# Altium schematic sheet ADCS_2.SchDoc
size A0 portrait; SheetNumber: 1; SheetTotal: 1
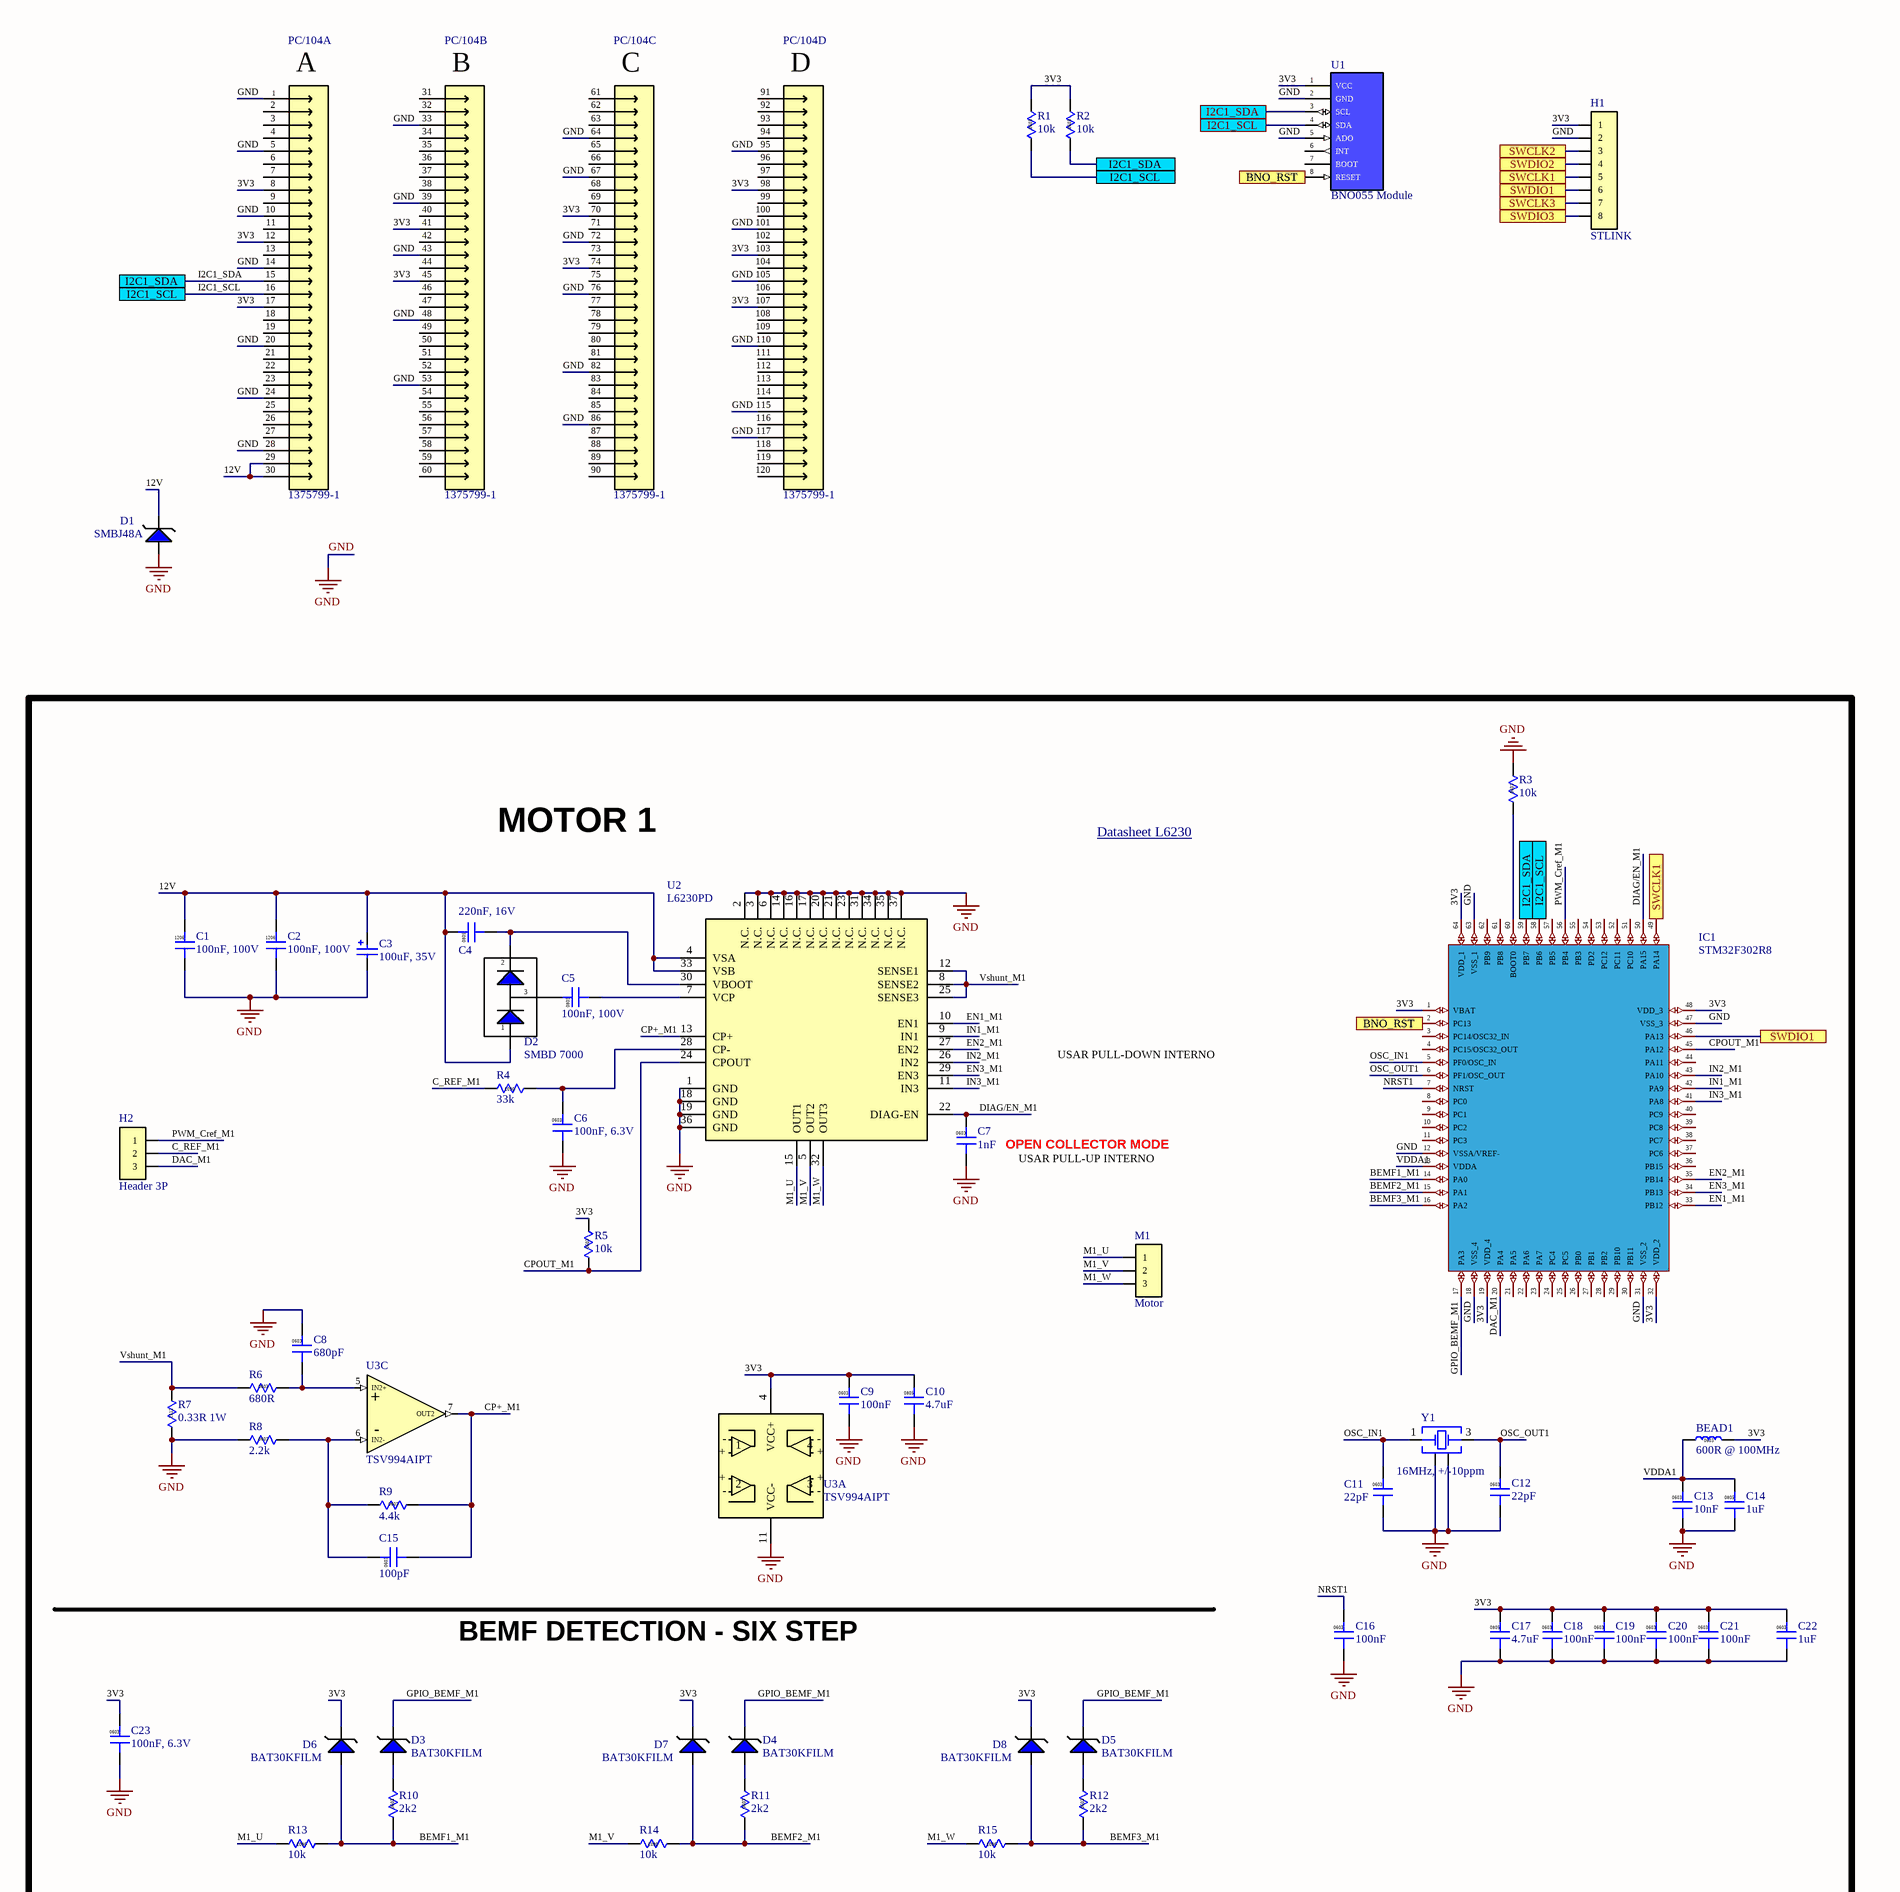
[diagram p0: ADCS_2.SchDoc, top]
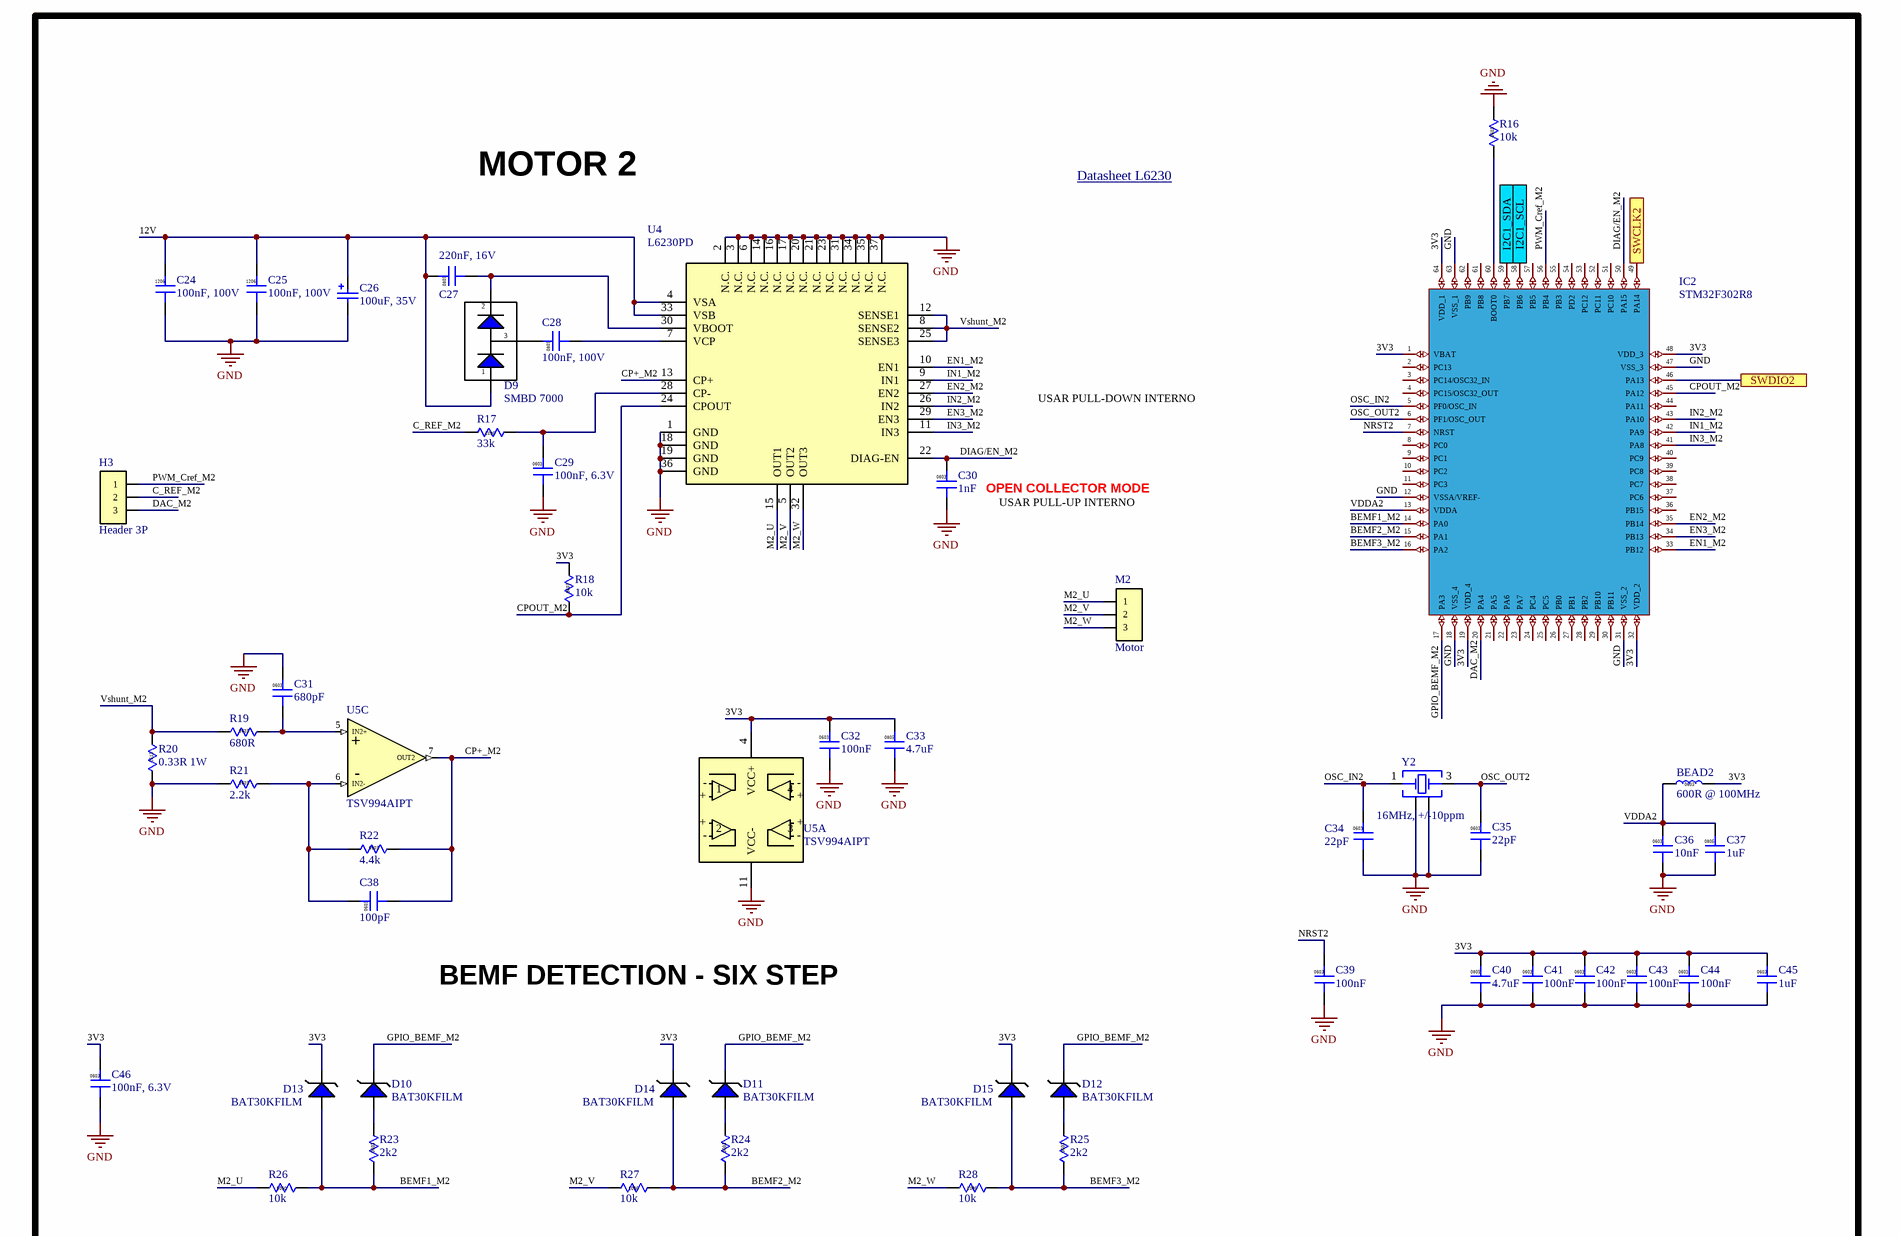
[diagram p1: ADCS_2.SchDoc, centre]
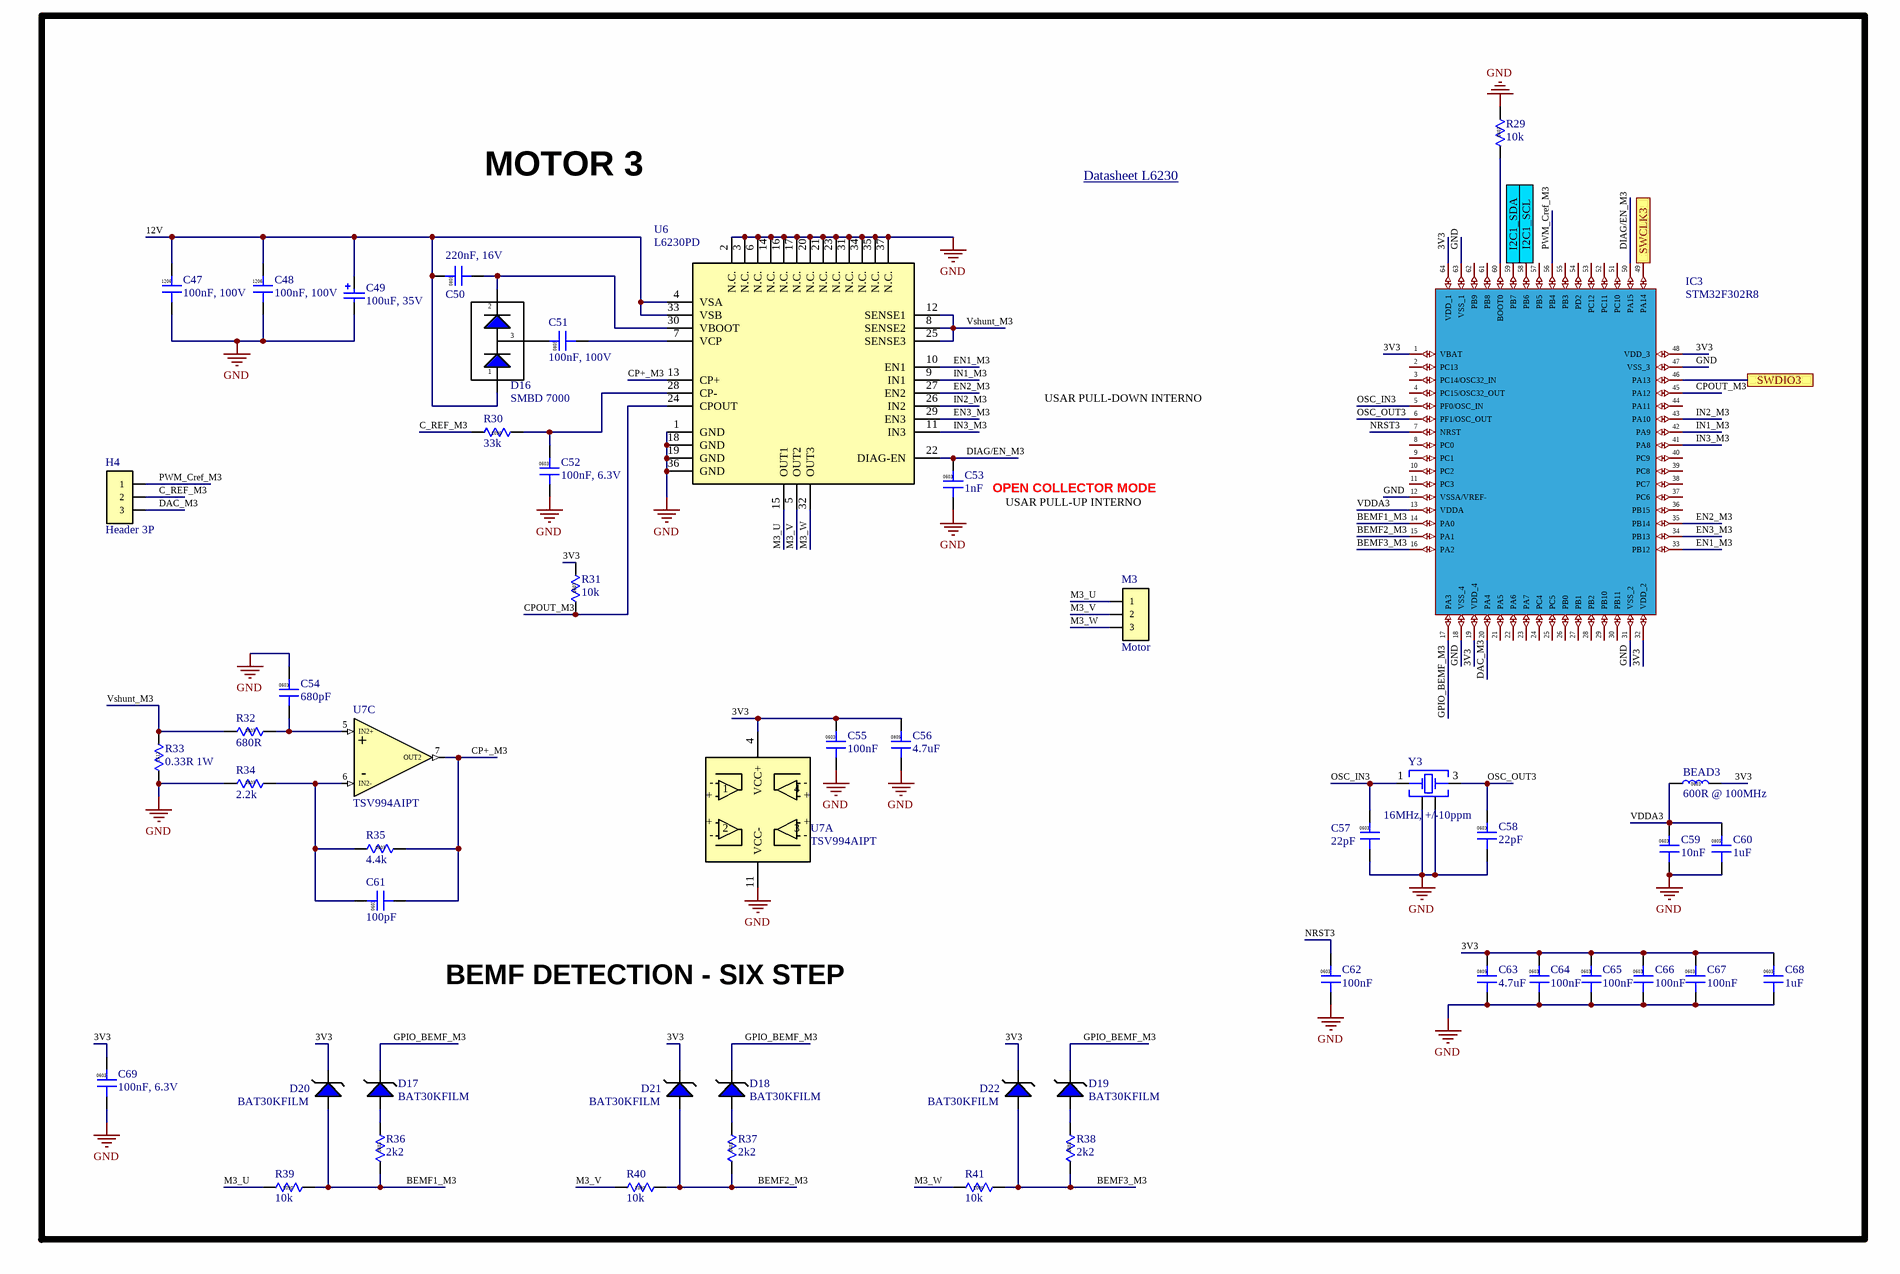
[diagram p2: ADCS_2.SchDoc, bottom]

## Parts
BEAD1  600R @ 100MHz  [IND0603]
BEAD2  600R @ 100MHz  [IND0603]
BEAD3  600R @ 100MHz  [IND0603]
C1  100nF, 100V  [CAP1206_090]
C2  100nF, 100V  [CAP1206_090]
C3  100uF, 35V  [WCAP-ASLI_6.3x7.7]
C4  220nF, 16V  [CAP0805_085]
C5  100nF, 100V  [CAP0805_085]
C6  100nF, 6.3V  [CAP0603_060]
C7  1nF  [CAP0603_060]
C8  680pF  [CAP0603_060]
C9  100nF  [CAP0603_060]
C10  4.7uF  [CAP0805_085]
C11  22pF  [CAP0603_060]
C12  22pF  [CAP0603_060]
C13  10nF  [CAP0603_040]
C14  1uF  [CAP0805_085]
C15  100pF  [CAP0603_060]
C16  100nF  [CAP0603_060]
C17  4.7uF  [CAP0805_125]
C18  100nF  [CAP0603_060]
C19  100nF  [CAP0603_060]
C20  100nF  [CAP0603_060]
C21  100nF  [CAP0603_060]
C22  1uF  [CAP0603_090]
C23  100nF, 6.3V  [CAP0603_060]
C24  100nF, 100V  [CAP1206_090]
C25  100nF, 100V  [CAP1206_090]
C26  100uF, 35V  [WCAP-ASLI_6.3x7.7]
C27  220nF, 16V  [CAP0805_085]
C28  100nF, 100V  [CAP0805_085]
C29  100nF, 6.3V  [CAP0603_060]
C30  1nF  [CAP0603_060]
C31  680pF  [CAP0603_060]
C32  100nF  [CAP0603_060]
C33  4.7uF  [CAP0805_085]
C34  22pF  [CAP0603_060]
C35  22pF  [CAP0603_060]
C36  10nF  [CAP0603_040]
C37  1uF  [CAP0805_085]
C38  100pF  [CAP0603_060]
C39  100nF  [CAP0603_060]
C40  4.7uF  [CAP0805_125]
C41  100nF  [CAP0603_060]
C42  100nF  [CAP0603_060]
C43  100nF  [CAP0603_060]
C44  100nF  [CAP0603_060]
C45  1uF  [CAP0603_090]
C46  100nF, 6.3V  [CAP0603_060]
C47  100nF, 100V  [CAP1206_090]
C48  100nF, 100V  [CAP1206_090]
C49  100uF, 35V  [WCAP-ASLI_6.3x7.7]
C50  220nF, 16V  [CAP0805_085]
C51  100nF, 100V  [CAP0805_085]
C52  100nF, 6.3V  [CAP0603_060]
C53  1nF  [CAP0603_060]
C54  680pF  [CAP0603_060]
C55  100nF  [CAP0603_060]
C56  4.7uF  [CAP0805_085]
C57  22pF  [CAP0603_060]
C58  22pF  [CAP0603_060]
C59  10nF  [CAP0603_040]
C60  1uF  [CAP0805_085]
C61  100pF  [CAP0603_060]
C62  100nF  [CAP0603_060]
C63  4.7uF  [CAP0805_125]
C64  100nF  [CAP0603_060]
C65  100nF  [CAP0603_060]
C66  100nF  [CAP0603_060]
C67  100nF  [CAP0603_060]
C68  1uF  [CAP0603_090]
C69  100nF, 6.3V  [CAP0603_060]
D1  SMBJ48A  [DO-214AA]
D2  SMBD 7000  [SOT-23]
D3  BAT30KFILM  [SOD-523]
D4  BAT30KFILM  [SOD-523]
D5  BAT30KFILM  [SOD-523]
D6  BAT30KFILM  [SOD-523]
D7  BAT30KFILM  [SOD-523]
D8  BAT30KFILM  [SOD-523]
D9  SMBD 7000  [SOT-23]
D10  BAT30KFILM  [SOD-523]
D11  BAT30KFILM  [SOD-523]
D12  BAT30KFILM  [SOD-523]
D13  BAT30KFILM  [SOD-523]
D14  BAT30KFILM  [SOD-523]
D15  BAT30KFILM  [SOD-523]
D16  SMBD 7000  [SOT-23]
D17  BAT30KFILM  [SOD-523]
D18  BAT30KFILM  [SOD-523]
D19  BAT30KFILM  [SOD-523]
D20  BAT30KFILM  [SOD-523]
D21  BAT30KFILM  [SOD-523]
D22  BAT30KFILM  [SOD-523]
H1  STLINK  [Header-8P]
H2  Header 3P  [Header-3P]
H3  Header 3P  [Header-3P]
H4  Header 3P  [Header-3P]
IC1  STM32F302R8  [LQFP-64-10X10X5]
IC2  STM32F302R8  [LQFP-64-10X10X5]
IC3  STM32F302R8  [LQFP-64-10X10X5]
M1  Motor  [Header-3P]
M2  Motor  [Header-3P]
M3  Motor  [Header-3P]
PC/104  1375799-1  [1375799-1]  (parts A,B,C,D of 4)
R1  10k  [RES0603]
R2  10k  [RES0603]
R3  10k  [RES0603]
R4  33k  [RES0603]
R5  10k  [RES0603]
R6  680R  [RES0603]
R7  0.33R 1W  [RES2512]
R8  2.2k  [RES0603]
R9  4.4k  [RES0603]
R10  2k2  [RES0603]
R11  2k2  [RES0603]
R12  2k2  [RES0603]
R13  10k  [RES0603]
R14  10k  [RES0603]
R15  10k  [RES0603]
R16  10k  [RES0603]
R17  33k  [RES0603]
R18  10k  [RES0603]
R19  680R  [RES0603]
R20  0.33R 1W  [RES2512]
R21  2.2k  [RES0603]
R22  4.4k  [RES0603]
R23  2k2  [RES0603]
R24  2k2  [RES0603]
R25  2k2  [RES0603]
R26  10k  [RES0603]
R27  10k  [RES0603]
R28  10k  [RES0603]
R29  10k  [RES0603]
R30  33k  [RES0603]
R31  10k  [RES0603]
R32  680R  [RES0603]
R33  0.33R 1W  [RES2512]
R34  2.2k  [RES0603]
R35  4.4k  [RES0603]
R36  2k2  [RES0603]
R37  2k2  [RES0603]
R38  2k2  [RES0603]
R39  10k  [RES0603]
R40  10k  [RES0603]
R41  10k  [RES0603]
U1  BNO055 Module  [BNO055_M_TH]
U2  L6230PD  [SOP65P1420X360-37N]
U3  TSV994AIPT  [SOP65P640X120-14N]  (parts A,C of 5)
U4  L6230PD  [SOP65P1420X360-37N]
U5  TSV994AIPT  [SOP65P640X120-14N]  (parts A,C of 5)
U6  L6230PD  [SOP65P1420X360-37N]
U7  TSV994AIPT  [SOP65P640X120-14N]  (parts A,C of 5)
Y1  16MHz, +/-10ppm  [WE-XTAL_CFPX-180]
Y2  16MHz, +/-10ppm  [WE-XTAL_CFPX-180]
Y3  16MHz, +/-10ppm  [WE-XTAL_CFPX-180]

## Blocks framed on the sheet
MOTOR 1: BEAD1 C1-C23 D2-D8 H2 IC1 M1 R3-R15 U2 U3 Y1
MOTOR 2: BEAD2 C24-C46 D9-D15 H3 IC2 M2 R16-R28 U4 U5 Y2
MOTOR 3: BEAD3 C47-C69 D16-D22 H4 IC3 M3 R29-R41 U6 U7 Y3

## Ports
BNO_RST, I2C1_SCL, I2C1_SDA, SWCLK1, SWCLK2, SWCLK3, SWDIO1, SWDIO2, SWDIO3

## Nets
GND: C1.2 C2.2 C3.1(N) C6.2 C7.2 C8.1 C9.2 C10.2 C11.2 C12.2 C13.2 C14.2 C16.2 C17.2 C18.2 C19.2 C20.2 C21.2 C22.2 C23.2 C24.2 C25.2 C26.1(N) C29.2 C30.2 C31.1 C32.2 C33.2 C34.2 C35.2 C36.2 C37.2 C39.2 C40.2 C41.2 C42.2 C43.2 C44.2 C45.2 C46.2 C47.2 C48.2 C49.1(N) C52.2 C53.2 C54.1 C55.2 C56.2 C57.2 C58.2 C59.2 C60.2 C62.2 C63.2 C64.2 C65.2 C66.2 C67.2 C68.2 C69.2 D1.1 H1.2 IC1.12(VSSA/VREF-) IC1.18(VSS_4) IC1.31(VSS_2) IC1.47(VSS_3) IC1.63(VSS_1) IC2.12(VSSA/VREF-) IC2.18(VSS_4) IC2.31(VSS_2) IC2.47(VSS_3) IC2.63(VSS_1) IC3.12(VSSA/VREF-) IC3.18(VSS_4) IC3.31(VSS_2) IC3.47(VSS_3) IC3.63(VSS_1) PC/104.1 PC/104.5 PC/104.10 PC/104.14 PC/104.20 PC/104.24 PC/104.28 PC/104.33 PC/104.39 PC/104.43 PC/104.48 PC/104.53 PC/104.64 PC/104.67 PC/104.72 PC/104.76 PC/104.82 PC/104.86 PC/104.95 PC/104.101 PC/104.105 PC/104.110 PC/104.115 PC/104.117 R3.2 R7.1 R8.1 R16.2 R20.1 R21.1 R29.2 R33.1 R34.1 U1.2(GND) U1.5(ADO) U2.1(GND) U2.2(N.C.) U2.3(N.C.) U2.6(N.C.) U2.14(N.C.) U2.16(N.C.) U2.17(N.C.) U2.18(GND) U2.19(GND) U2.20(N.C.) U2.21(N.C.) U2.23(N.C.) U2.31(N.C.) U2.34(N.C.) U2.35(N.C.) U2.36(GND) U2.37(N.C.) U3.11(VCC-) U4.1(GND) U4.2(N.C.) U4.3(N.C.) U4.6(N.C.) U4.14(N.C.) U4.16(N.C.) U4.17(N.C.) U4.18(GND) U4.19(GND) U4.20(N.C.) U4.21(N.C.) U4.23(N.C.) U4.31(N.C.) U4.34(N.C.) U4.35(N.C.) U4.36(GND) U4.37(N.C.) U5.11(VCC-) U6.1(GND) U6.2(N.C.) U6.3(N.C.) U6.6(N.C.) U6.14(N.C.) U6.16(N.C.) U6.17(N.C.) U6.18(GND) U6.19(GND) U6.20(N.C.) U6.21(N.C.) U6.23(N.C.) U6.31(N.C.) U6.34(N.C.) U6.35(N.C.) U6.36(GND) U6.37(N.C.) U7.11(VCC-) Y1.2(GND) Y1.4(GND) Y2.2(GND) Y2.4(GND) Y3.2(GND) Y3.4(GND)
3V3: BEAD1.2 BEAD2.2 BEAD3.2 C9.1 C10.1 C17.1 C18.1 C19.1 C20.1 C21.1 C22.1 C23.1 C32.1 C33.1 C40.1 C41.1 C42.1 C43.1 C44.1 C45.1 C46.1 C55.1 C56.1 C63.1 C64.1 C65.1 C66.1 C67.1 C68.1 C69.1 D6.2 D7.2 D8.2 D13.2 D14.2 D15.2 D20.2 D21.2 D22.2 H1.1 IC1.1(VBAT) IC1.19(VDD_4) IC1.32(VDD_2) IC1.48(VDD_3) IC1.64(VDD_1) IC2.1(VBAT) IC2.19(VDD_4) IC2.32(VDD_2) IC2.48(VDD_3) IC2.64(VDD_1) IC3.1(VBAT) IC3.19(VDD_4) IC3.32(VDD_2) IC3.48(VDD_3) IC3.64(VDD_1) PC/104.8 PC/104.12 PC/104.17 PC/104.41 PC/104.45 PC/104.70 PC/104.74 PC/104.98 PC/104.103 PC/104.107 R1.2 R2.2 R5.2 R18.2 R31.2 U1.1(VCC) U3.4(VCC+) U5.4(VCC+) U7.4(VCC+)
12V: C1.1 C2.1 C3.2(P) C4.1 C24.1 C25.1 C26.2(P) C27.1 C47.1 C48.1 C49.2(P) C50.1 D1.2 D2.1 D9.1 D16.1 PC/104.29 PC/104.30 U2.4(VSA) U2.33(VSB) U4.4(VSA) U4.33(VSB) U6.4(VSA) U6.33(VSB)
BEMF1_M1: D6.1 IC1.14(PA0) R10.1 R13.1
BEMF1_M2: D13.1 IC2.14(PA0) R23.1 R26.1
BEMF1_M3: D20.1 IC3.14(PA0) R36.1 R39.1
BEMF2_M1: D7.1 IC1.15(PA1) R11.1 R14.1
BEMF2_M2: D14.1 IC2.15(PA1) R24.1 R27.1
BEMF2_M3: D21.1 IC3.15(PA1) R37.1 R40.1
BEMF3_M1: D8.1 IC1.16(PA2) R12.1 R15.1
BEMF3_M2: D15.1 IC2.16(PA2) R25.1 R28.1
BEMF3_M3: D22.1 IC3.16(PA2) R38.1 R41.1
BNO_RST: IC1.2(PC13) U1.8(RESET) ; port BNO_RST
C_REF_M1: H2.2 R4.2
C_REF_M2: H3.2 R17.2
C_REF_M3: H4.2 R30.2
CP+_M1: C15.2 R9.2 U2.13(CP+) U3.7(OUT2)
CP+_M2: C38.2 R22.2 U4.13(CP+) U5.7(OUT2)
CP+_M3: C61.2 R35.2 U6.13(CP+) U7.7(OUT2)
CPOUT_M1: IC1.45(PA12) R5.1 U2.24(CPOUT)
CPOUT_M2: IC2.45(PA12) R18.1 U4.24(CPOUT)
CPOUT_M3: IC3.45(PA12) R31.1 U6.24(CPOUT)
DAC_M1: H2.3 IC1.20(PA4)
DAC_M2: H3.3 IC2.20(PA4)
DAC_M3: H4.3 IC3.20(PA4)
DIAG/EN_M1: C7.1 IC1.50(PA15) U2.22(DIAG-EN)
DIAG/EN_M2: C30.1 IC2.50(PA15) U4.22(DIAG-EN)
DIAG/EN_M3: C53.1 IC3.50(PA15) U6.22(DIAG-EN)
EN1_M1: IC1.33(PB12) U2.10(EN1)
EN1_M2: IC2.33(PB12) U4.10(EN1)
EN1_M3: IC3.33(PB12) U6.10(EN1)
EN2_M1: IC1.35(PB14) U2.27(EN2)
EN2_M2: IC2.35(PB14) U4.27(EN2)
EN2_M3: IC3.35(PB14) U6.27(EN2)
EN3_M1: IC1.34(PB13) U2.29(EN3)
EN3_M2: IC2.34(PB13) U4.29(EN3)
EN3_M3: IC3.34(PB13) U6.29(EN3)
GPIO_BEMF_M1: D3.2 D4.2 D5.2 IC1.17(PA3)
GPIO_BEMF_M2: D10.2 D11.2 D12.2 IC2.17(PA3)
GPIO_BEMF_M3: D17.2 D18.2 D19.2 IC3.17(PA3)
I2C1_SCL: IC1.58(PB6) IC2.58(PB6) IC3.58(PB6) PC/104.16 R1.1 U1.4(SDA) ; port I2C1_SCL
I2C1_SDA: IC1.59(PB7) IC2.59(PB7) IC3.59(PB7) PC/104.15 R2.1 U1.3(SCL) ; port I2C1_SDA
IN1_M1: IC1.42(PA9) U2.9(IN1)
IN1_M2: IC2.42(PA9) U4.9(IN1)
IN1_M3: IC3.42(PA9) U6.9(IN1)
IN2_M1: IC1.43(PA10) U2.26(IN2)
IN2_M2: IC2.43(PA10) U4.26(IN2)
IN2_M3: IC3.43(PA10) U6.26(IN2)
IN3_M1: IC1.41(PA8) U2.11(IN3)
IN3_M2: IC2.41(PA8) U4.11(IN3)
IN3_M3: IC3.41(PA8) U6.11(IN3)
M1_U: M1.1 R13.2 U2.15(OUT1)
M1_V: M1.2 R14.2 U2.5(OUT2)
M1_W: M1.3 R15.2 U2.32(OUT3)
M2_U: M2.1 R26.2 U4.15(OUT1)
M2_V: M2.2 R27.2 U4.5(OUT2)
M2_W: M2.3 R28.2 U4.32(OUT3)
M3_U: M3.1 R39.2 U6.15(OUT1)
M3_V: M3.2 R40.2 U6.5(OUT2)
M3_W: M3.3 R41.2 U6.32(OUT3)
NRST1: C16.1 IC1.7(NRST)
NRST2: C39.1 IC2.7(NRST)
NRST3: C62.1 IC3.7(NRST)
OSC_IN1: C11.1 IC1.5(PF0/OSC_IN) Y1.1(Crystal)
OSC_IN2: C34.1 IC2.5(PF0/OSC_IN) Y2.1(Crystal)
OSC_IN3: C57.1 IC3.5(PF0/OSC_IN) Y3.1(Crystal)
OSC_OUT1: C12.1 IC1.6(PF1/OSC_OUT) Y1.3(Crystal)
OSC_OUT2: C35.1 IC2.6(PF1/OSC_OUT) Y2.3(Crystal)
OSC_OUT3: C58.1 IC3.6(PF1/OSC_OUT) Y3.3(Crystal)
PWM_Cref_M1: H2.1 IC1.56(PB4)
PWM_Cref_M2: H3.1 IC2.56(PB4)
PWM_Cref_M3: H4.1 IC3.56(PB4)
SWCLK1: H1.5 IC1.49(PA14) ; port SWCLK1
SWCLK2: H1.3 IC2.49(PA14) ; port SWCLK2
SWCLK3: H1.7 IC3.49(PA14) ; port SWCLK3
SWDIO1: H1.6 IC1.46(PA13) ; port SWDIO1
SWDIO2: H1.4 IC2.46(PA13) ; port SWDIO2
SWDIO3: H1.8 IC3.46(PA13) ; port SWDIO3
VDDA1: BEAD1.1 C13.1 C14.1 IC1.13(VDDA)
VDDA2: BEAD2.1 C36.1 C37.1 IC2.13(VDDA)
VDDA3: BEAD3.1 C59.1 C60.1 IC3.13(VDDA)
Vshunt_M1: R6.1 R7.2 U2.8(SENSE2) U2.12(SENSE1) U2.25(SENSE3)
Vshunt_M2: R19.1 R20.2 U4.8(SENSE2) U4.12(SENSE1) U4.25(SENSE3)
Vshunt_M3: R32.1 R33.2 U6.8(SENSE2) U6.12(SENSE1) U6.25(SENSE3)
NetC4_2: C4.2 D2.2 U2.30(VBOOT)
NetC5_1: C5.1 D2.3
NetC5_2: C5.2 U2.7(VCP)
NetC6_1: C6.1 R4.1 U2.28(CP-)
NetC8_2: C8.2 R6.2 U3.5(IN2+)
NetC15_1: C15.1 R8.2 R9.1 U3.6(IN2-)
NetC27_2: C27.2 D9.2 U4.30(VBOOT)
NetC28_1: C28.1 D9.3
NetC28_2: C28.2 U4.7(VCP)
NetC29_1: C29.1 R17.1 U4.28(CP-)
NetC31_2: C31.2 R19.2 U5.5(IN2+)
NetC38_1: C38.1 R21.2 R22.1 U5.6(IN2-)
NetC50_2: C50.2 D16.2 U6.30(VBOOT)
NetC51_1: C51.1 D16.3
NetC51_2: C51.2 U6.7(VCP)
NetC52_1: C52.1 R30.1 U6.28(CP-)
NetC54_2: C54.2 R32.2 U7.5(IN2+)
NetC61_1: C61.1 R34.2 R35.1 U7.6(IN2-)
NetD3_1: D3.1 R10.2
NetD4_1: D4.1 R11.2
NetD5_1: D5.1 R12.2
NetD10_1: D10.1 R23.2
NetD11_1: D11.1 R24.2
NetD12_1: D12.1 R25.2
NetD17_1: D17.1 R36.2
NetD18_1: D18.1 R37.2
NetD19_1: D19.1 R38.2
NetIC1_60: IC1.60(BOOT0) R3.1
NetIC2_60: IC2.60(BOOT0) R16.1
NetIC3_60: IC3.60(BOOT0) R29.1

Not connected (* = marked no-connect by the designer): IC1 3(PC14/OSC32_IN) 4(PC15/OSC32_OUT) 8(PC0) 9(PC1) 10(PC2) 11(PC3) 21(PA5) 22(PA6) 23(PA7) 24(PC4) 25(PC5) 26(PB0) 27(PB1) 28(PB2) 29(PB10) 30(PB11) 36(PB15) 37(PC6) 38(PC7) 39(PC8) 40(PC9) 44(PA11) 51(PC10) 52(PC11) 53(PC12) 54(PD2) 55(PB3) 57(PB5) 61(PB8) 62(PB9); IC2 2(PC13) 3(PC14/OSC32_IN) 4(PC15/OSC32_OUT) 8(PC0) 9(PC1) 10(PC2) 11(PC3) 21(PA5) 22(PA6) 23(PA7) 24(PC4) 25(PC5) 26(PB0) 27(PB1) 28(PB2) 29(PB10) 30(PB11) 36(PB15) 37(PC6) 38(PC7) 39(PC8) 40(PC9) 44(PA11) 51(PC10) 52(PC11) 53(PC12) 54(PD2) 55(PB3) 57(PB5) 61(PB8) 62(PB9); IC3 2(PC13) 3(PC14/OSC32_IN) 4(PC15/OSC32_OUT) 8(PC0) 9(PC1) 10(PC2) 11(PC3) 21(PA5) 22(PA6) 23(PA7) 24(PC4) 25(PC5) 26(PB0) 27(PB1) 28(PB2) 29(PB10) 30(PB11) 36(PB15) 37(PC6) 38(PC7) 39(PC8) 40(PC9) 44(PA11) 51(PC10) 52(PC11) 53(PC12) 54(PD2) 55(PB3) 57(PB5) 61(PB8) 62(PB9); PC/104 2 3 4 6 7 9 11 13 18 19 21 22 23 25 26 27 31 32 34 35 36 37 38 40 42 44 46 47 49 50 51 52 54 55 56 57 58 59 60 61 62 63 65 66 68 69 71 73 75 77 78 79 80 81 83 84 85 87 88 89 90 91 92 93 94 96 97 99 100 102 104 106 108 109 111 112 113 114 116 118 119 120; U1 6(INT) 7(BOOT)

## Notes on the sheet
- Datasheet L6230 <https://www.st.com/resource/en/datasheet/l6230.pdf>
- USAR PULL-DOWN INTERNO
- (near C7) OPEN COLLECTOR MODE
- USAR PULL-UP INTERNO
- BEMF DETECTION - SIX STEP
- (near C30) OPEN COLLECTOR MODE
- (near C53) OPEN COLLECTOR MODE
- (in symbol 1375799-1, part A) A
- (in symbol 1375799-1, part B) B
- (in symbol 1375799-1, part C) C
- (in symbol 1375799-1, part D) D
- (in symbol CAP0603) 0603
- (in symbol CAP0805) 0805
- (in symbol CAP1206) 1206
- (in symbol IND0603) 0603
- (in symbol RES0603) 0603
- (in symbol RES2512) 2512
- (in symbol TSV994, part A) -; +
- (in symbol TSV994, part C) +; -

## Library data of the parts
BEAD1-BEAD3 = IND0603: Indutor SDM 0603
C1 C2 C24 C25 C47 C48 = CAP1206: Capacitor SDM 1206
C3 C26 C49 = 865080545012: WCAP-ASLI Aluminum Electrolytic Capacitor, V-Chip, SMT, D6.3xH7.7mm, 100uF, 35V; Manufacturer: Wurth Elektronik; Dissipation Factor: 14%; Endurance: 2000h; Leakage Current: 35uA; Ripple Current: 300mA; Capacitance Tolerance: +/-20%; Rated Voltage: 35VDC; Technical Reference: ASED077101M035DVCTCB000; ComponentLink1Description: Manufacturer; ComponentLink1URL: http://www.we-online.de; ComponentLink2Description: Datasheet; ComponentLink2URL: https://www.we-online.com/catalog/datasheet/865080545012.pdf; Height: 7.7mm; Mounting Technology: SMT; Operating Temperature: -55 to +105degC; Packaging: Tape and Reel; Published Date: May 2020; Capacitance: 100uF; Diameter: 6.3mm; Manufacturer Part Number: 865080545012
C4 C5 C10 C14 C17 C27 C28 C33 C37 C40 C50 C51 C56 C60 C63 = CAP0805: Capacitor SDM 0805
C6-C9 C11-C13 C15 C16 C18-C23 C29-C32 C34-C36 C38 C39 C41-C46 C52-C55 C57-C59 C61 C62 C64-C69 = CAP0603: Capacitor SDM 0603
D1 = SMBJ48A: The SMBJ series is designed specifically to protect / sensitive electronic equipment from voltage transients / induced by lightning and other transient voltage events.
D2 D9 D16 = SMBD7000: Silicon Switching Diode Array. / For high-speed switching applications.
D3-D8 D10-D15 D17-D22 = BAT30: The BAT30 series uses 30 V Schottky barrier / diodes encapsulated in SOD-523 or SOT-323 / packages. / This device is specially suited for switching mode / applications needing low forward voltage drop / diodes.
H1 = Header-8P: Header 8 Pinos
H2-H4 M1-M3 = Header-3P: Header 3 Pinos
IC1-IC3 = STM32F302R: Mainstream Mixed signals MCUs Arm Cortex-M4 core with DSP and FPU, 128 Kbytes of Flash memory, 72 MHz CPU, MPU, CCM, 12-bit ADC 5 MSPS, PGA, comparators
PC/104 = 1375799-1: AMPMODU PC/104, PC/104 Connectors, Board-to-Board, 120 Position, 2mm [.079in] Centerline, Printed Circuit Board, 3A Contact Current Rating (Max)
R1-R6 R8-R19 R21-R32 R34-R41 = RES0603: Resistor SMD 0603
R7 R20 R33 = RES2512
U1 = BNO055_M: Smart sensor combining accelerometer, gyroscope, magnetometer and orientation software. Euler angles, quaternion, rotation vector, etc.
U2 U4 U6 = L6230: DMOS driver for three-phase brushless DC motor
U3 U5 U7 = TSV994: Rail-to-rail input/output 20 MHz GBP operational amplifiers; Manufacturer_Name: STMicroelectronics; Datasheet Link: http://www.st.com/st-web-ui/static/active/en/resource/technical/document/datasheet/CD00144611.pdf; Height: 1.2mm; Manufacturer_Part_Number: TSV994AIPT; Mouser Part Number: 511-TSV994AIPT; Mouser Price/Stock: https://www.mouser.co.uk/ProductDetail/STMicroelectronics/TSV994AIPT/?qs=Djavi1aLnwoYgszHfckxOw%3D%3D; Arrow Part Number: TSV994AIPT; Arrow Price/Stock: https://www.arrow.com/en/products/tsv994aipt/stmicroelectronics
Y1-Y3 = 830100965009: WE-XTAL Quartz Crystal, SMT, CFPX-180, 16MHz, +/-10ppm; Manufacturer: Wurth Elektronik; Frequency Stability: +/-20ppm; Load Capacitance: 16pF; ComponentLink1Description: Manufacturer; ComponentLink1URL: http://www.we-online.de; ComponentLink2Description: Datasheet; ComponentLink2URL: https://katalog.we-online.com/pbs/datasheet/830100965009.pdf; Operating Temperature: -40 to +85degC; Packaging: Tape and Reel; Manufacturer Part Number: 830100965009; Published Date: July 2020; Size: CFPX-180; Frequency: 16MHz; Frequency Tolerance: +/-10ppm; Mounting Technology: SMT